# EAGLE schematic FPGA board V2 (EAGLE 7.6.0)

## Sheet 1 of 6: Power
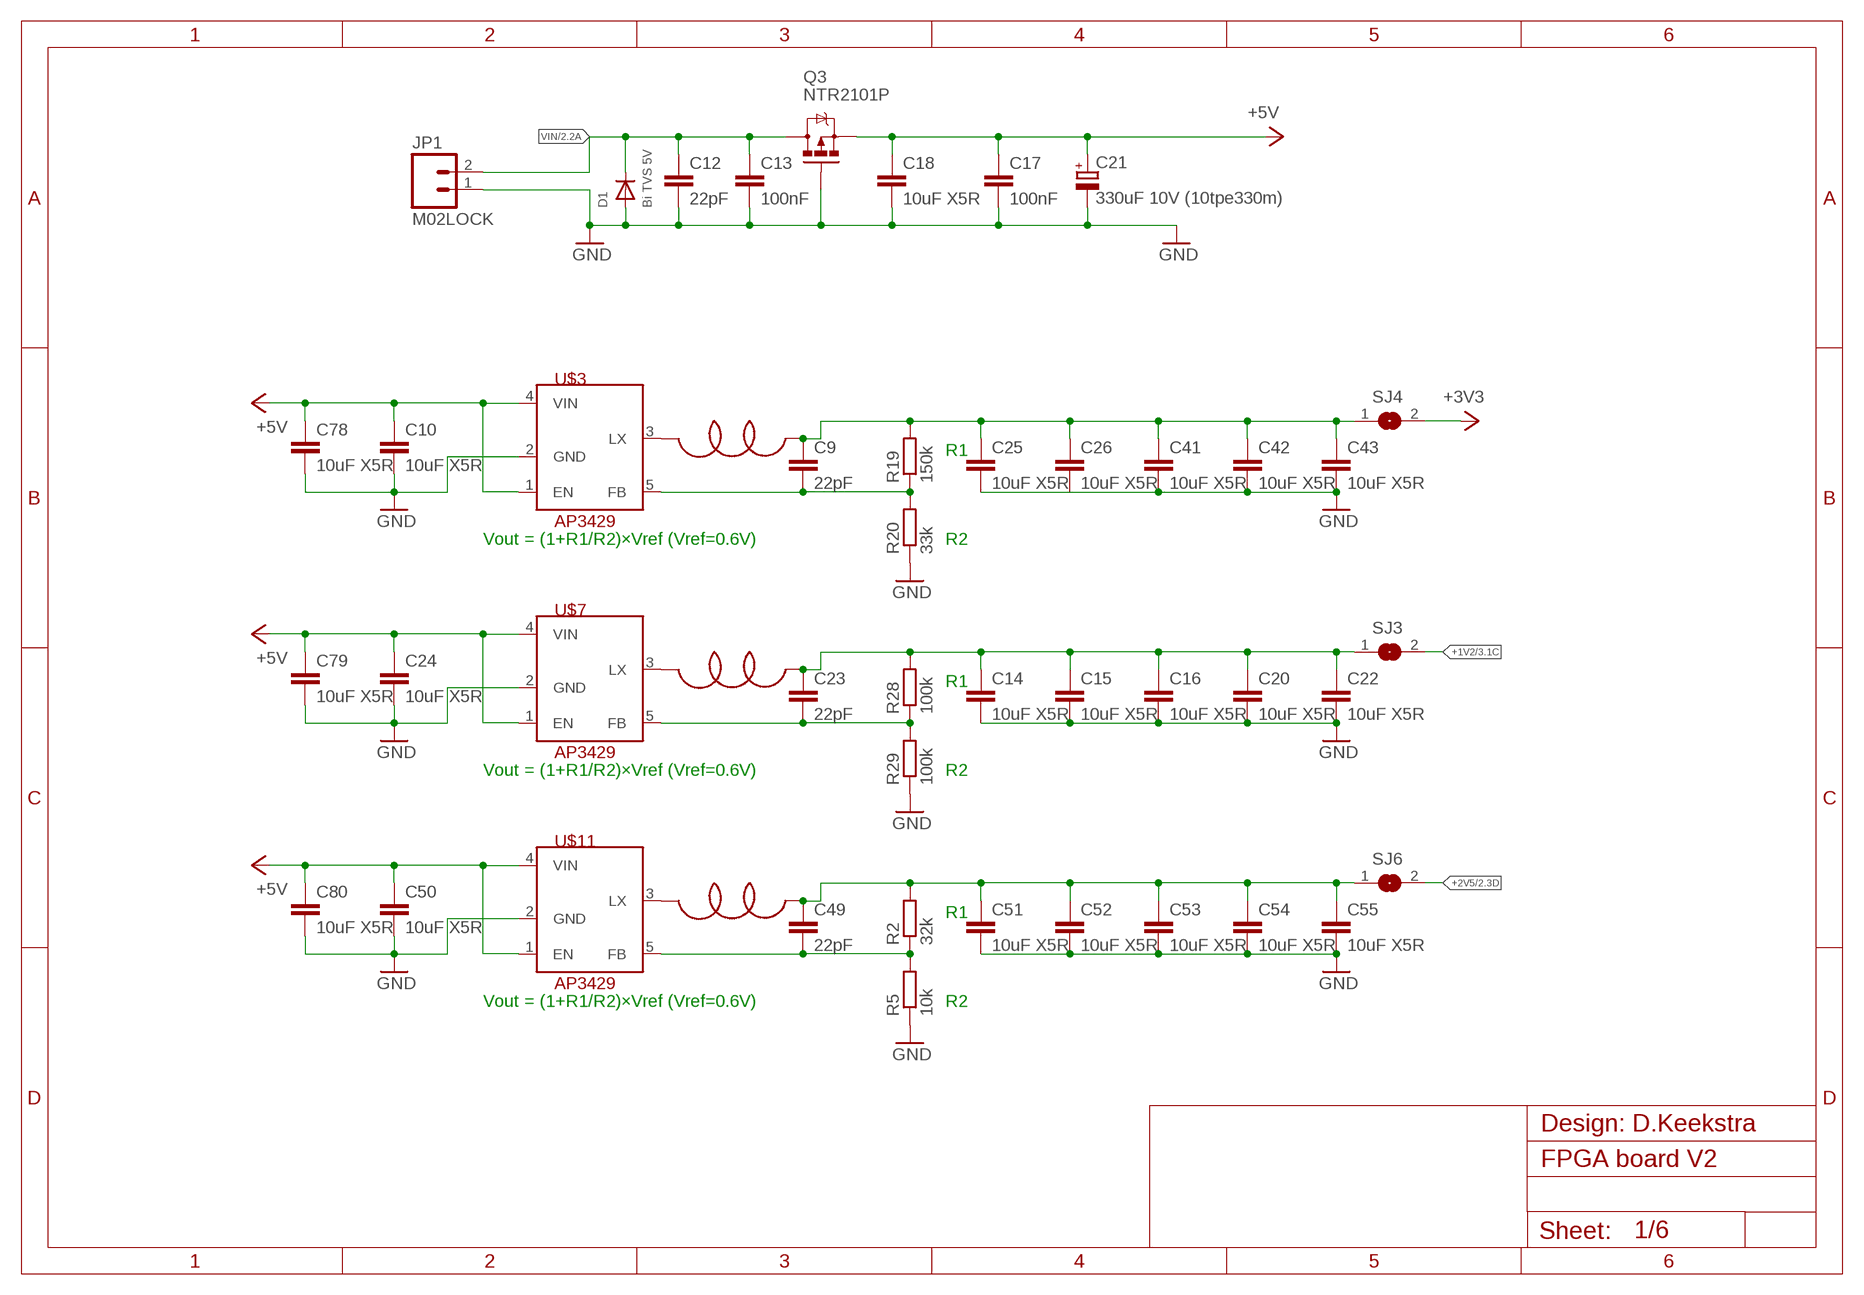
[diagram p0: schematic, sheet 1]

### Parts
C9  22pF  C-EUC0603  [C0603]
C10  10uF X5R  C-EUC0805K  [C0805K]
C12  22pF  C-EUC0603  [C0603]
C13  100nF  C-EUC0603  [C0603]
C14  10uF X5R  C-EUC0805K  [C0805K]
C15  10uF X5R  C-EUC0805K  [C0805K]
C16  10uF X5R  C-EUC0805K  [C0805K]
C17  100nF  C-EUC0603  [C0603]
C18  10uF X5R  C-EUC0805K  [C0805K]
C20  10uF X5R  C-EUC0805K  [C0805K]
C21  330uF 10V (10tpe330m)  CPOL-EUD/7343-31W  [D/7343-31W]
C22  10uF X5R  C-EUC0805K  [C0805K]
C23  22pF  C-EUC0603  [C0603]
C24  10uF X5R  C-EUC0805K  [C0805K]
C25  10uF X5R  C-EUC0805K  [C0805K]
C26  10uF X5R  C-EUC0805K  [C0805K]
C41  10uF X5R  C-EUC0805K  [C0805K]
C42  10uF X5R  C-EUC0805K  [C0805K]
C43  10uF X5R  C-EUC0805K  [C0805K]
C49  22pF  C-EUC0603  [C0603]
C50  10uF X5R  C-EUC0805K  [C0805K]
C51  10uF X5R  C-EUC0805K  [C0805K]
C52  10uF X5R  C-EUC0805K  [C0805K]
C53  10uF X5R  C-EUC0805K  [C0805K]
C54  10uF X5R  C-EUC0805K  [C0805K]
C55  10uF X5R  C-EUC0805K  [C0805K]
C78  10uF X5R  C-EUC0805K  [C0805K]
C79  10uF X5R  C-EUC0805K  [C0805K]
C80  10uF X5R  C-EUC0805K  [C0805K]
D1  Bi TVS 5V  DIODESOD-523  [SOD-523]
JP1  M02LOCK  [1X02_LOCK]
L2  3.3uH 1.9A PWR  SLF7032T3R3M1R9-2-PF  [SLF7032T]
L3  3.3uH 1.9A PWR  SLF7032T3R3M1R9-2-PF  [SLF7032T]
L4  3.3uH 1.9A PWR  SLF7032T3R3M1R9-2-PF  [SLF7032T]
Q3  NTR2101P  MOSFET-PCHANNELIRLML2244  [SOT23-3]
R2  32k  R-EU_R0603  [R0603]
R5  10k  R-EU_R0603  [R0603]
R19  150k  R-EU_R0603  [R0603]
R20  33k  R-EU_R0603  [R0603]
R28  100k  R-EU_R0603  [R0603]
R29  100k  R-EU_R0603  [R0603]
SJ3  SJ  [SJ]
SJ4  SJ  [SJ]
SJ6  SJ  [SJ]
U$3  AP3429  [TSOT-25]
U$7  AP3429  [TSOT-25]
U$11  AP3429  [TSOT-25]

### Nets
+1V2: SJ3.2 ; also sheet 3
+2V5: SJ6.2 ; also sheet 2,3
+3V3: SJ4.2 ; also sheet 3,4,5,6
+5V: C10.1 C17.1 C18.1 C21.+ C24.1 C50.1 C78.1 C79.1 C80.1 Q3.2(S) U$3.1(EN) U$3.4(VIN) U$7.1(EN) U$7.4(VIN) U$11.1(EN) U$11.4(VIN) ; also sheet 6
GND: C10.2 C12.2 C13.2 C14.2 C15.2 C16.2 C17.2 C18.2 C20.2 C21.- C22.2 C24.2 C25.2 C26.2 C41.2 C42.2 C43.2 C50.2 C51.2 C52.2 C53.2 C54.2 C55.2 C78.2 C79.2 C80.2 D1.A JP1.1 Q3.1(G) R5.1 R20.1 R29.1 U$3.2(GND) U$7.2(GND) U$11.2(GND) ; also sheet 2,3,4,5,6
L2: C9.1 C25.1 C26.1 C41.1 C42.1 C43.1 L2.P$1 R19.2 SJ4.1
N$4: L3.P$2 U$11.3(LX)
N$8: C49.1 C51.1 C52.1 C53.1 C54.1 C55.1 L3.P$1 R2.2 SJ6.1
N$9: C49.2 R2.1 R5.2 U$11.5(FB)
N$29: C14.1 C15.1 C16.1 C20.1 C22.1 C23.1 L4.P$1 R28.2 SJ3.1
N$30: C23.2 R28.1 R29.2 U$7.5(FB)
N$78: L2.P$2 U$3.3(LX)
N$82: C9.2 R19.1 R20.2 U$3.5(FB)
N$88: L4.P$2 U$7.3(LX)
VIN: C12.1 C13.1 D1.K(C) JP1.2 Q3.3(D) ; also sheet 2

### Notes on the sheet
- R1
- Vout = (1+R1/R2)×Vref (Vref=0.6V) | R2
- R1
- Vout = (1+R1/R2)×Vref (Vref=0.6V) | R2
- R1
- Vout = (1+R1/R2)×Vref (Vref=0.6V) | R2
- Design: D.Keekstra

## Sheet 2 of 6: USB-Blaster
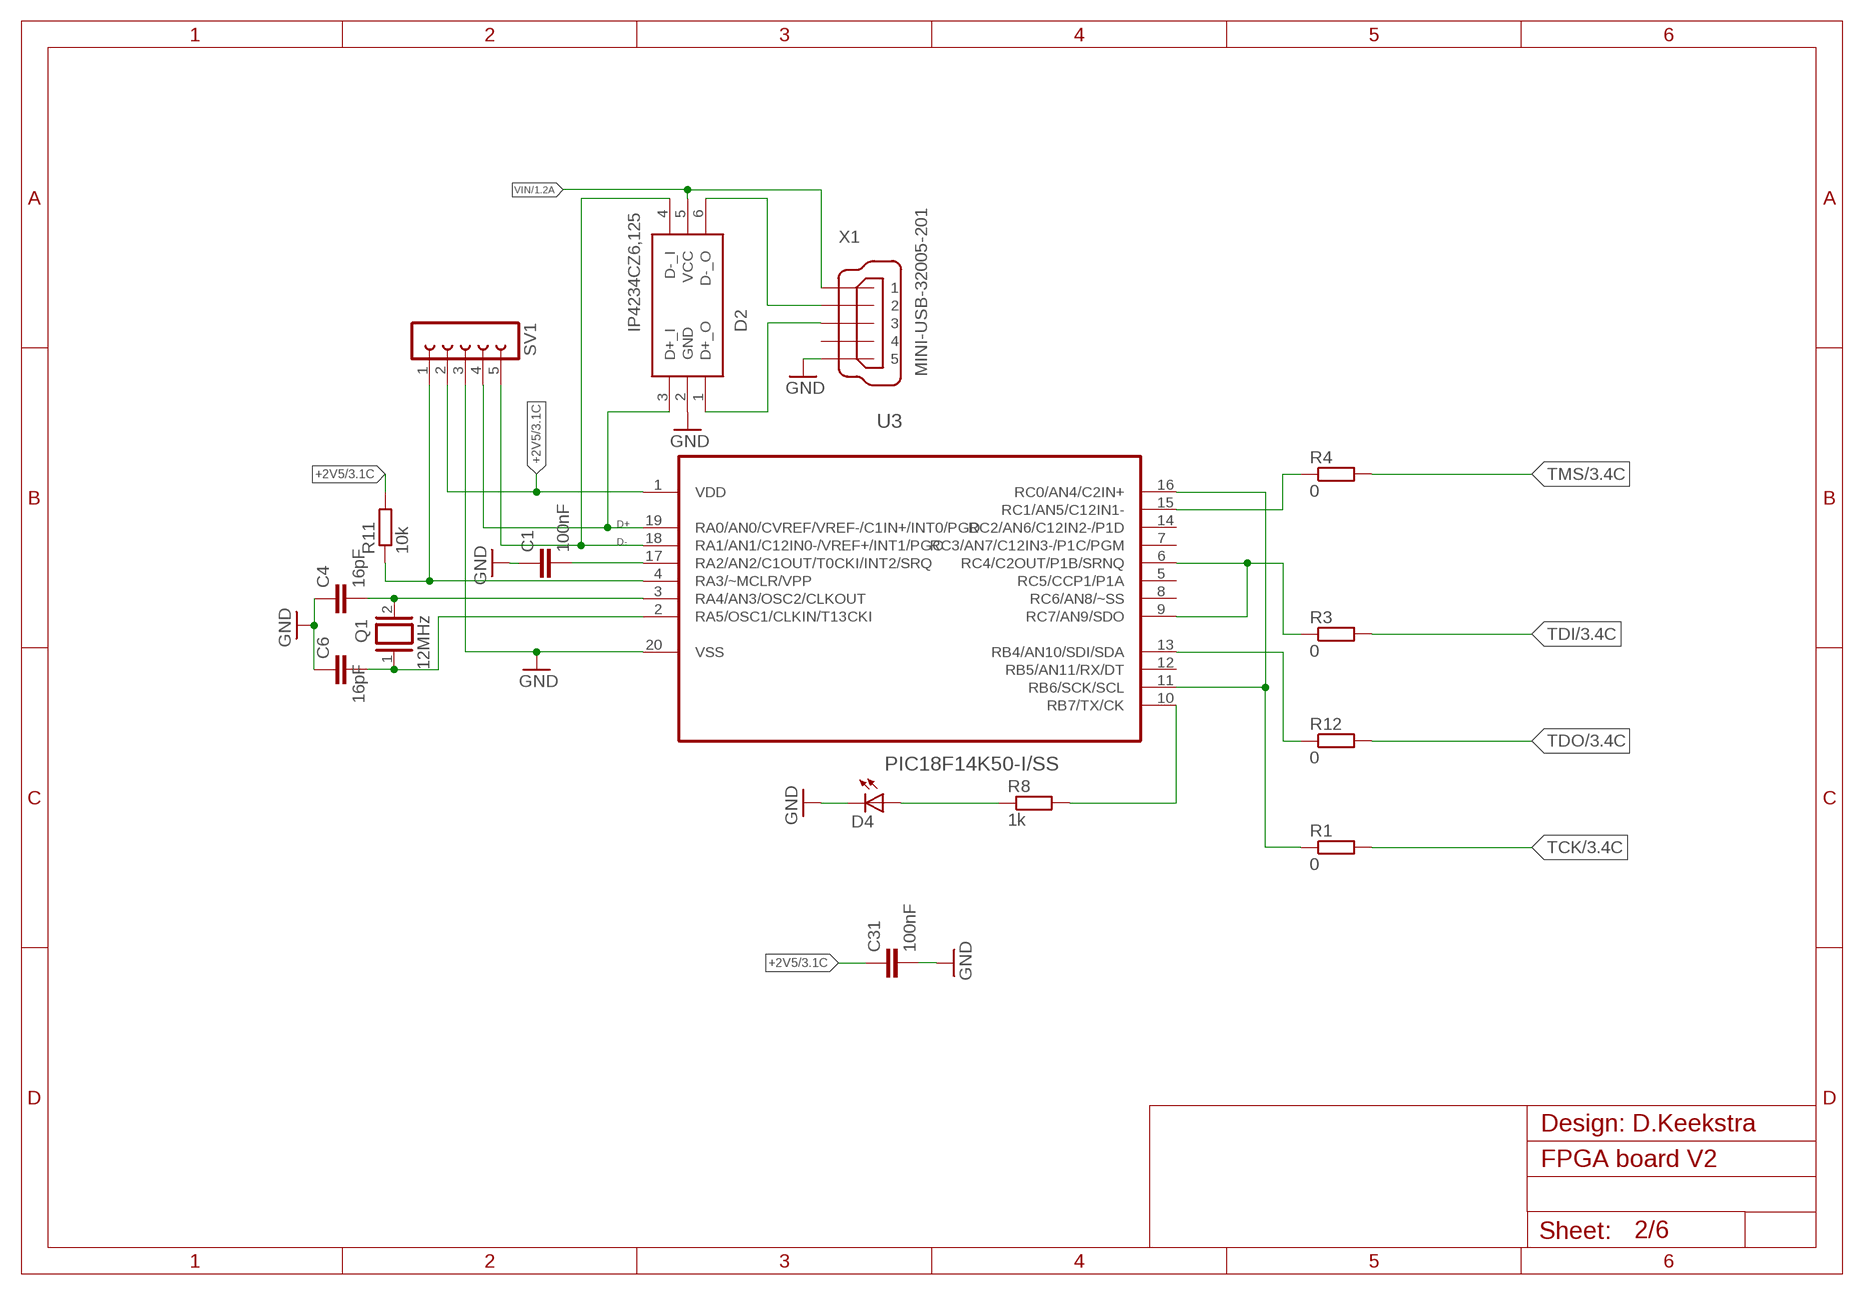
[diagram p1: schematic, sheet 2]

### Parts
C1  100nF  C-EUC0603  [C0603]
C4  16pF  C-EUC0603  [C0603]
C6  16pF  C-EUC0603  [C0603]
C31  100nF  C-EUC0603  [C0603]
D2  IP4234CZ6,125  [SOT95P275X110-6N]
D4  LED0805  [CHIPLED_0805]
Q1  12MHz  XTAL/S  [QS]
R1  0  R-EU_R0603  [R0603]
R3  0  R-EU_R0603  [R0603]
R4  0  R-EU_R0603  [R0603]
R8  1k  R-EU_R0603  [R0603]
R11  10k  R-EU_R0603  [R0603]
R12  0  R-EU_R0603  [R0603]
SV1  FE05-1  [FE05-1]
U3  PIC18F14K50-I/SS  [SOP65P780X200-20N]
X1  MINI-USB-32005-201  [32005-201]

### Nets
+2V5: C31.1 R11.2 SV1.2 U3.1(VDD) ; also sheet 1,3
D+: D2.3(D+_I) SV1.4 U3.19(RA0/AN0/CVREF/VREF-/C1IN+/INT0/PGD)
D-: D2.4(D-_I) SV1.5 U3.18(RA1/AN1/C12IN0-/VREF+/INT1/PGC)
GND: C1.1 C4.1 C6.1 C31.2 D2.2(GND) D4.C SV1.3 U3.20(VSS) X1.5 ; also sheet 1,3,4,5,6
N$1: R8.2 U3.10(RB7/TX/CK)
N$2: D4.A R8.1
N$3: R1.1 U3.11(RB6/SCK/SCL) U3.16(RC0/AN4/C2IN+)
N$5: C1.2 U3.17(RA2/AN2/C1OUT/T0CKI/INT2/SRQ)
N$6: R4.1 U3.15(RC1/AN5/C12IN1-)
N$7: R11.1 SV1.1 U3.4(RA3/~MCLR/VPP)
N$10: R3.1 U3.6(RC4/C2OUT/P1B/SRNQ) U3.9(RC7/AN9/SDO)
N$11: D2.1(D+_O) X1.3
N$12: R12.1 U3.13(RB4/AN10/SDI/SDA)
N$13: D2.6(D-_O) X1.2
N$16: C4.2 Q1.2 U3.3(RA4/AN3/OSC2/CLKOUT)
N$17: C6.2 Q1.1 U3.2(RA5/OSC1/CLKIN/T13CKI)
TCK: R1.2 ; also sheet 3
TDI: R3.2 ; also sheet 3
TDO: R12.2 ; also sheet 3
TMS: R4.2 ; also sheet 3
VIN: D2.5(VCC) X1.1 ; also sheet 1
Unconnected: U3.5(RC5/CCP1/P1A) U3.7(RC3/AN7/C12IN3-/P1C/PGM) U3.8(RC6/AN8/~SS) U3.12(RB5/AN11/RX/DT) U3.14(RC2/AN6/C12IN2-/P1D) X1.4

### Notes on the sheet
- Design: D.Keekstra

## Sheet 3 of 6: FPGA
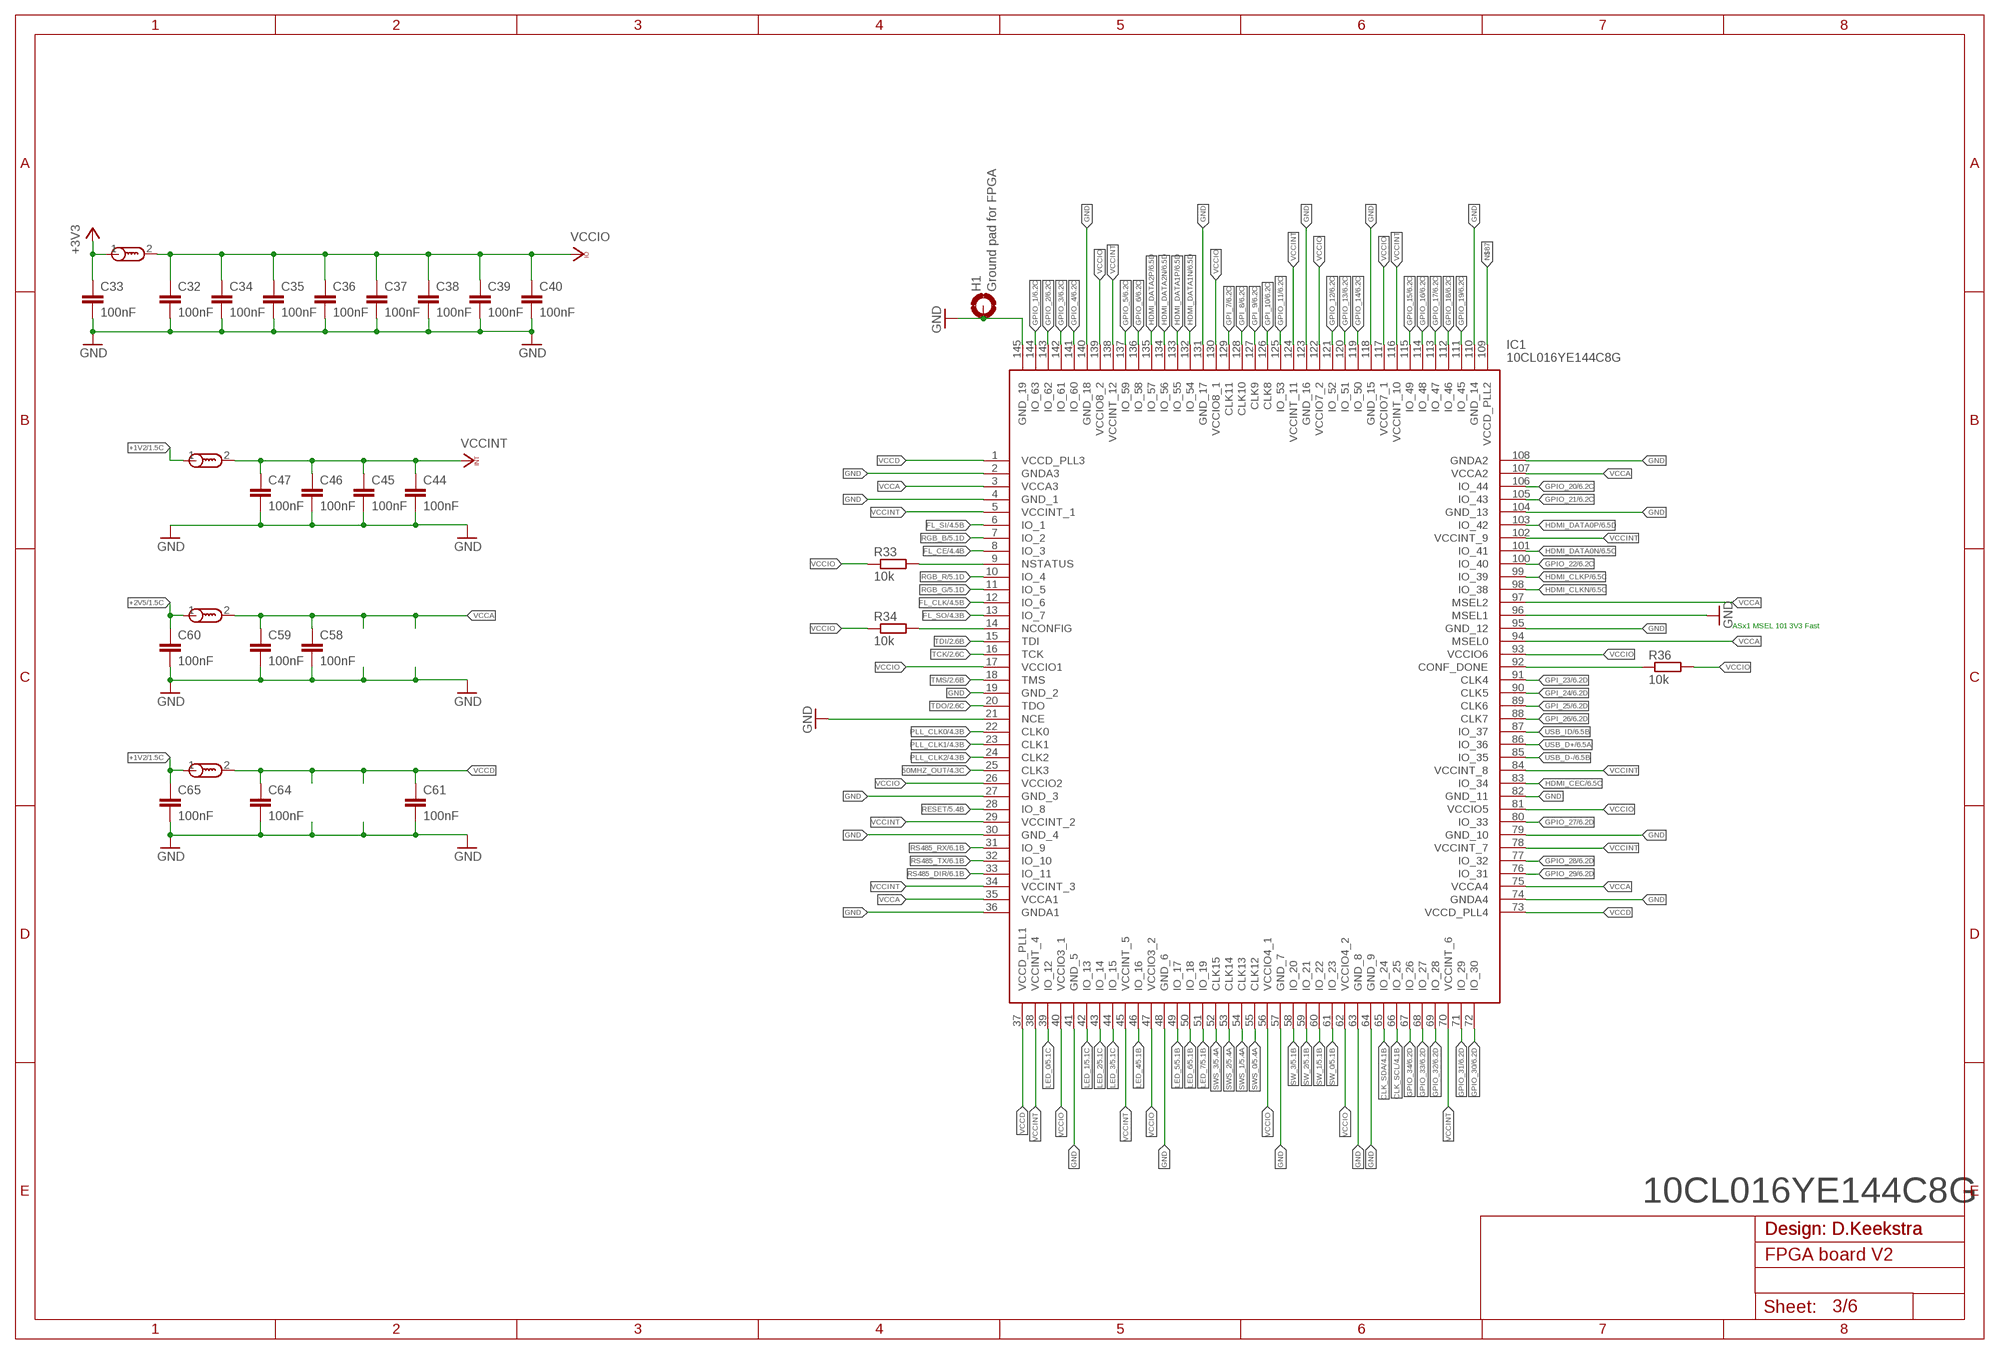
[diagram p2: schematic, sheet 3]

### Parts
B1  B-EU  [C0603]
B2  B-EU  [C0603]
B3  B-EU  [C0603]
B4  B-EU  [C0603]
C32  100nF  C-EUC0603  [C0603]
C33  100nF  C-EUC0603  [C0603]
C34  100nF  C-EUC0603  [C0603]
C35  100nF  C-EUC0603  [C0603]
C36  100nF  C-EUC0603  [C0603]
C37  100nF  C-EUC0603  [C0603]
C38  100nF  C-EUC0603  [C0603]
C39  100nF  C-EUC0603  [C0603]
C40  100nF  C-EUC0603  [C0603]
C44  100nF  C-EUC0603  [C0603]
C45  100nF  C-EUC0603  [C0603]
C46  100nF  C-EUC0603  [C0603]
C47  100nF  C-EUC0603  [C0603]
C58  100nF  C-EUC0603  [C0603]
C59  100nF  C-EUC0603  [C0603]
C60  100nF  C-EUC0603  [C0603]
C61  100nF  C-EUC0603  [C0603]
C64  100nF  C-EUC0603  [C0603]
C65  100nF  C-EUC0603  [C0603]
H1  Ground pad for FPGA  MOUNT-PAD-ROUND2.8  [2,8-PAD]
IC1  10CL016YE144C8G  [QFP50P2200X2200X165-145N]
R33  10k  R-EU_R0603  [R0603]
R34  10k  R-EU_R0603  [R0603]
R36  10k  R-EU_R0603  [R0603]

### Nets
50MHZ_OUT: IC1.25(CLK3) ; also sheet 4
+1V2: B2.1 B4.1 C65.1 ; also sheet 1
+2V5: B3.1 C60.1 ; also sheet 1,2
+3V3: B1.1 C33.1 ; also sheet 1,4,5,6
CLK_SCL: IC1.66(IO_25) ; also sheet 4,6
CLK_SDA: IC1.65(IO_24) ; also sheet 4,6
FL_CE: IC1.8(IO_3) ; also sheet 4
FL_CLK: IC1.12(IO_6) ; also sheet 4
FL_SI: IC1.6(IO_1) ; also sheet 4
FL_SO: IC1.13(IO_7) ; also sheet 4
GND: C32.2 C33.2 C34.2 C35.2 C36.2 C37.2 C38.2 C39.2 C40.2 C44.2 C45.2 C46.2 C47.2 C58.2 C59.2 C60.2 C61.2 C64.2 C65.2 H1.B2,8(MOUNT) IC1.2(GNDA3) IC1.4(GND_1) IC1.19(GND_2) IC1.21(NCE) IC1.27(GND_3) IC1.30(GND_4) IC1.36(GNDA1) IC1.41(GND_5) IC1.48(GND_6) IC1.57(GND_7) IC1.63(GND_8) IC1.64(GND_9) IC1.74(GNDA4) IC1.79(GND_10) IC1.82(GND_11) IC1.95(GND_12) IC1.96(MSEL1) IC1.104(GND_13) IC1.108(GNDA2) IC1.110(GND_14) IC1.118(GND_15) IC1.123(GND_16) IC1.131(GND_17) IC1.140(GND_18) IC1.145(GND_19) ; also sheet 1,2,4,5,6
GPI_7: IC1.129(CLK11) ; also sheet 6
GPI_8: IC1.128(CLK10) ; also sheet 6
GPI_9: IC1.127(CLK9) ; also sheet 6
GPI_10: IC1.126(CLK8) ; also sheet 6
GPI_23: IC1.91(CLK4) ; also sheet 6
GPI_24: IC1.90(CLK5) ; also sheet 6
GPI_25: IC1.89(CLK6) ; also sheet 6
GPI_26: IC1.88(CLK7) ; also sheet 6
GPIO_1: IC1.144(IO_63) ; also sheet 6
GPIO_2: IC1.143(IO_62) ; also sheet 6
GPIO_3: IC1.142(IO_61) ; also sheet 6
GPIO_4: IC1.141(IO_60) ; also sheet 6
GPIO_5: IC1.137(IO_59) ; also sheet 6
GPIO_6: IC1.136(IO_58) ; also sheet 6
GPIO_11: IC1.125(IO_53) ; also sheet 6
GPIO_12: IC1.121(IO_52) ; also sheet 6
GPIO_13: IC1.120(IO_51) ; also sheet 6
GPIO_14: IC1.119(IO_50) ; also sheet 6
GPIO_15: IC1.115(IO_49) ; also sheet 6
GPIO_16: IC1.114(IO_48) ; also sheet 6
GPIO_17: IC1.113(IO_47) ; also sheet 6
GPIO_18: IC1.112(IO_46) ; also sheet 6
GPIO_19: IC1.111(IO_45) ; also sheet 6
GPIO_20: IC1.106(IO_44) ; also sheet 6
GPIO_21: IC1.105(IO_43) ; also sheet 6
GPIO_22: IC1.100(IO_40) ; also sheet 6
GPIO_27: IC1.80(IO_33) ; also sheet 6
GPIO_28: IC1.77(IO_32) ; also sheet 6
GPIO_29: IC1.76(IO_31) ; also sheet 6
GPIO_30: IC1.72(IO_30) ; also sheet 6
GPIO_31: IC1.71(IO_29) ; also sheet 6
GPIO_32: IC1.69(IO_28) ; also sheet 6
GPIO_33: IC1.68(IO_27) ; also sheet 6
GPIO_34: IC1.67(IO_26) ; also sheet 6
HDMI_CEC: IC1.83(IO_34) ; also sheet 6
HDMI_CLKN: IC1.98(IO_38) ; also sheet 6
HDMI_CLKP: IC1.99(IO_39) ; also sheet 6
HDMI_DATA0N: IC1.101(IO_41) ; also sheet 6
HDMI_DATA0P: IC1.103(IO_42) ; also sheet 6
HDMI_DATA1N: IC1.132(IO_54) ; also sheet 6
HDMI_DATA1P: IC1.133(IO_55) ; also sheet 6
HDMI_DATA2N: IC1.134(IO_56) ; also sheet 6
HDMI_DATA2P: IC1.135(IO_57) ; also sheet 6
LED_0: IC1.39(IO_12) ; also sheet 5
LED_1: IC1.42(IO_13) ; also sheet 5
LED_2: IC1.43(IO_14) ; also sheet 5
LED_3: IC1.44(IO_15) ; also sheet 5
LED_4: IC1.46(IO_16) ; also sheet 5
LED_5: IC1.49(IO_17) ; also sheet 5
LED_6: IC1.50(IO_18) ; also sheet 5
LED_7: IC1.51(IO_19) ; also sheet 5
N$24: IC1.9(NSTATUS) R33.2
N$31: IC1.14(NCONFIG) R34.2
N$33: IC1.92(CONF_DONE) R36.1
N$87: IC1.109(VCCD_PLL2)
PLL_CLK0: IC1.22(CLK0) ; also sheet 4
PLL_CLK1: IC1.23(CLK1) ; also sheet 4
PLL_CLK2: IC1.24(CLK2) ; also sheet 4
RESET: IC1.28(IO_8) ; also sheet 5
RGB_B: IC1.7(IO_2) ; also sheet 5
RGB_G: IC1.11(IO_5) ; also sheet 5
RGB_R: IC1.10(IO_4) ; also sheet 5
RS485_DIR: IC1.33(IO_11) ; also sheet 6
RS485_RX: IC1.31(IO_9) ; also sheet 6
RS485_TX: IC1.32(IO_10) ; also sheet 6
SW_0: IC1.61(IO_23) ; also sheet 5
SW_1: IC1.60(IO_22) ; also sheet 5
SW_2: IC1.59(IO_21) ; also sheet 5
SW_3: IC1.58(IO_20) ; also sheet 5
SWS_0: IC1.55(CLK12) ; also sheet 5
SWS_1: IC1.54(CLK13) ; also sheet 5
SWS_2: IC1.53(CLK14) ; also sheet 5
SWS_3: IC1.52(CLK15) ; also sheet 5
TCK: IC1.16(TCK) ; also sheet 2
TDI: IC1.15(TDI) ; also sheet 2
TDO: IC1.20(TDO) ; also sheet 2
TMS: IC1.18(TMS) ; also sheet 2
USB_D+: IC1.86(IO_36) ; also sheet 6
USB_D-: IC1.85(IO_35) ; also sheet 6
USB_ID: IC1.87(IO_37) ; also sheet 6
VCCA: B3.2 C58.1 C59.1 IC1.3(VCCA3) IC1.35(VCCA1) IC1.75(VCCA4) IC1.94(MSEL0) IC1.97(MSEL2) IC1.107(VCCA2)
VCCD: B4.2 C61.1 C64.1 IC1.1(VCCD_PLL3) IC1.37(VCCD_PLL1) IC1.73(VCCD_PLL4)
VCCINT: B2.2 C44.1 C45.1 C46.1 C47.1 IC1.5(VCCINT_1) IC1.29(VCCINT_2) IC1.34(VCCINT_3) IC1.38(VCCINT_4) IC1.45(VCCINT_5) IC1.70(VCCINT_6) IC1.78(VCCINT_7) IC1.84(VCCINT_8) IC1.102(VCCINT_9) IC1.116(VCCINT_10) IC1.124(VCCINT_11) IC1.138(VCCINT_12)
VCCIO: B1.2 C32.1 C34.1 C35.1 C36.1 C37.1 C38.1 C39.1 C40.1 IC1.17(VCCIO1) IC1.26(VCCIO2) IC1.40(VCCIO3_1) IC1.47(VCCIO3_2) IC1.56(VCCIO4_1) IC1.62(VCCIO4_2) IC1.81(VCCIO5) IC1.93(VCCIO6) IC1.117(VCCIO7_1) IC1.122(VCCIO7_2) IC1.130(VCCIO8_1) IC1.139(VCCIO8_2) R33.1 R34.1 R36.2

### Notes on the sheet
- ASx1 MSEL 101 3V3 Fast
- 10CL016YE144C8G
- Design: D.Keekstra | Design: D.Keekstra

## Sheet 4 of 6: Clocks and Memory
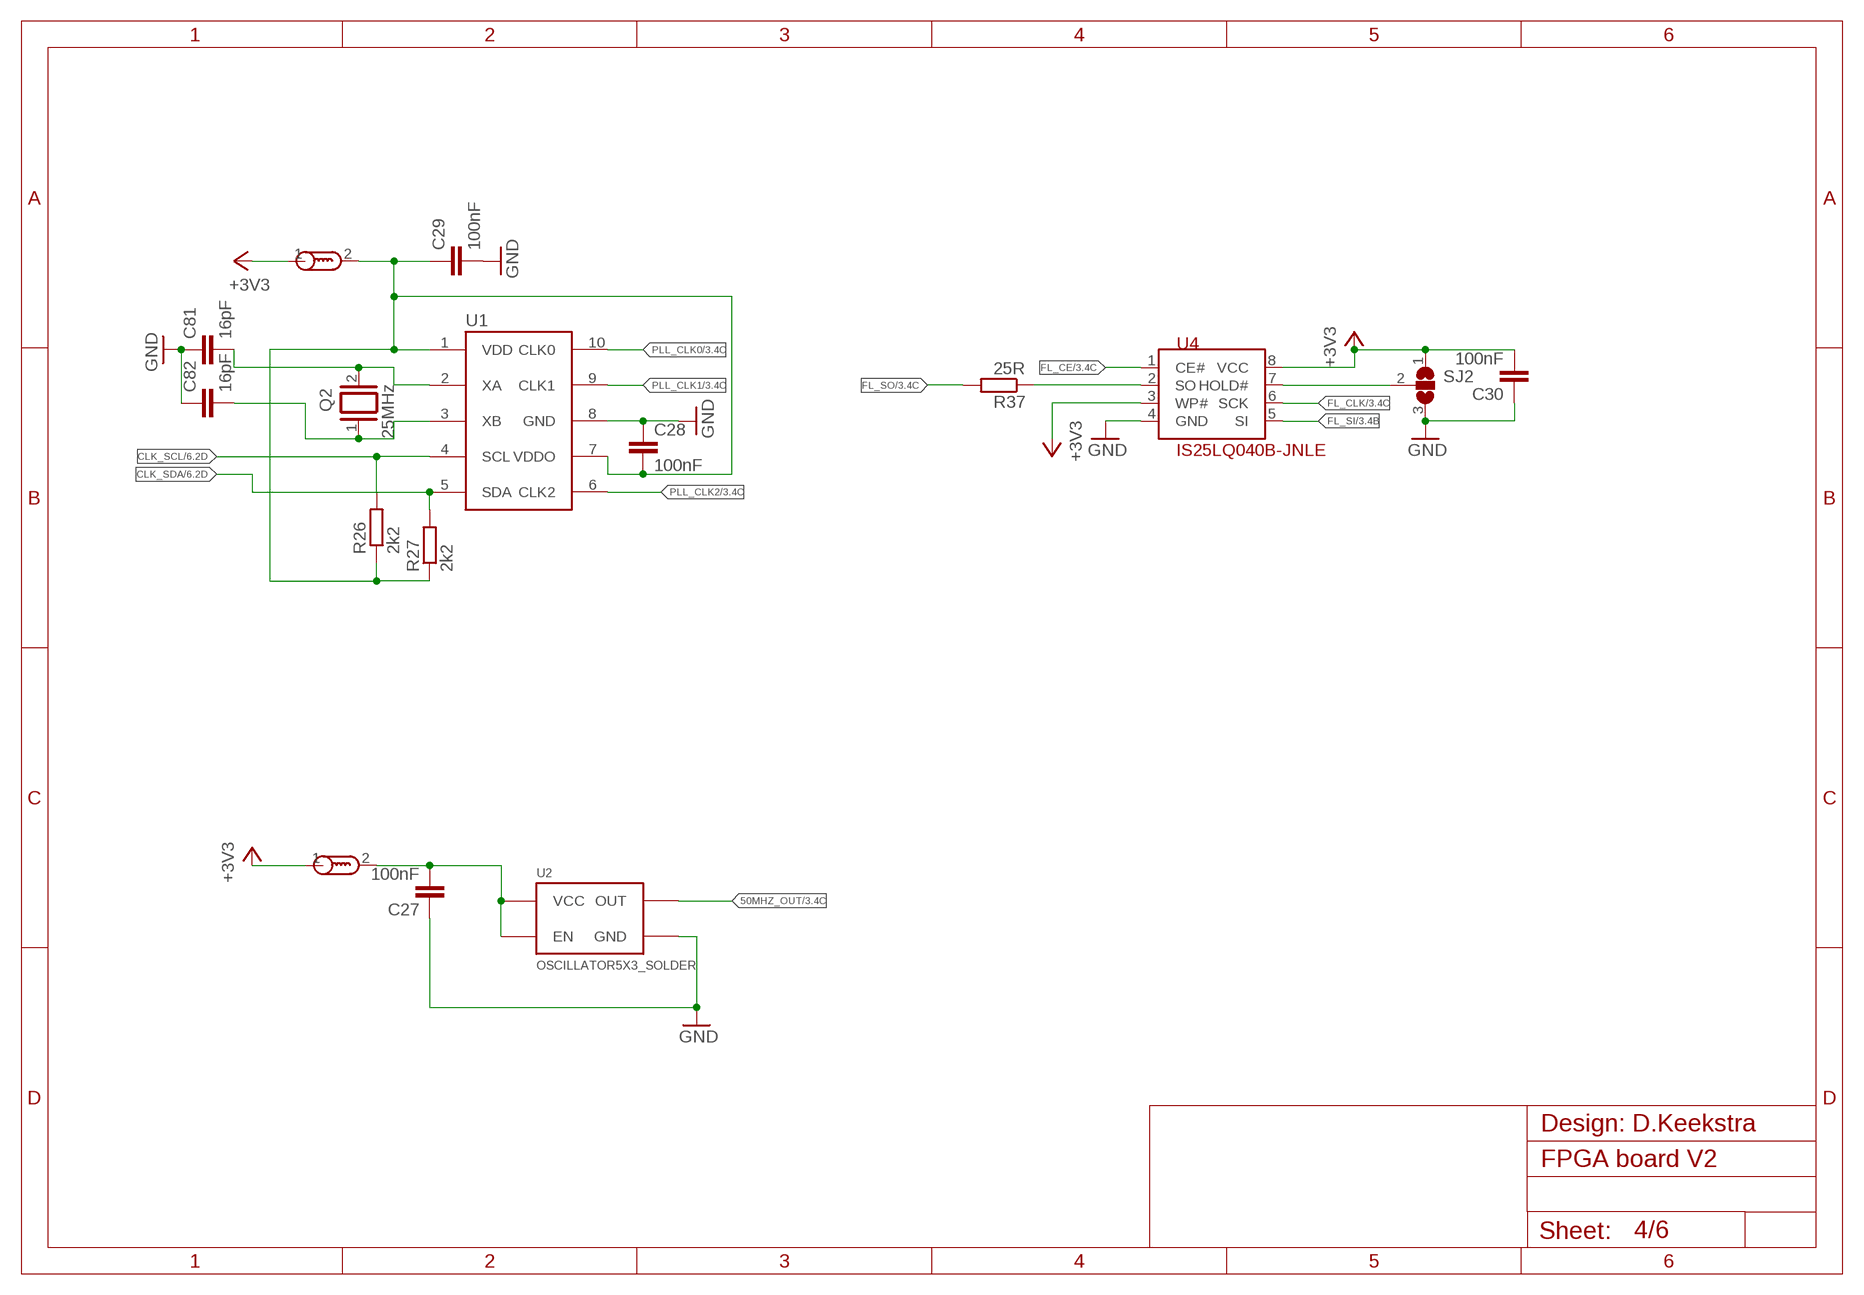
[diagram p3: schematic, sheet 4]

### Parts
B5  B-EU  [C0603]
B6  B-EU  [C0603]
C27  100nF  C-EUC0603  [C0603]
C28  100nF  C-EUC0603  [C0603]
C29  100nF  C-EUC0603  [C0603]
C30  100nF  C-EUC0603  [C0603]
C81  16pF  C-EUC0603  [C0603]
C82  16pF  C-EUC0603  [C0603]
Q2  25MHz  XTAL/S  [QS]
R26  2k2  R-EU_R0603  [R0603]
R27  2k2  R-EU_R0603  [R0603]
R37  25R  R-EU_R0603  [R0603]
SJ2  SJ2W  [SJ_2]
U1  SI5351A_CLOCK_GEN  [MSOP-10]
U2  OSCILLATOR5X3_SOLDER  [CRYSTAL-SMD-5X3_SOLDER]
U4  IS25LQ040B-JNLE  [SOIC8]

### Nets
50MHZ_OUT: U2.3(OUT) ; also sheet 3
+3V3: B5.1 B6.1 C30.2 SJ2.1 U4.3(WP#) U4.8(VCC) ; also sheet 1,3,5,6
CLK_SCL: R26.2 U1.4(SCL) ; also sheet 3,6
CLK_SDA: R27.2 U1.5(SDA) ; also sheet 3,6
FL_CE: U4.1(CE#) ; also sheet 3
FL_CLK: U4.6(SCK) ; also sheet 3
FL_SI: U4.5(SI) ; also sheet 3
FL_SO: R37.2 ; also sheet 3
GND: C27.1 C28.1 C29.2 C30.1 C81.1 C82.1 SJ2.3 U1.8(GND) U2.2(GND) U4.4(GND) ; also sheet 1,2,3,5,6
N$75: C82.2 Q2.1 U1.3(XB)
N$76: C81.2 Q2.2 U1.2(XA)
N$86: SJ2.2 U4.7(HOLD#)
N$91: B6.2 C28.2 C29.1 R26.1 R27.1 U1.1(VDD) U1.7(VDDO)
N$93: B5.2 C27.2 U2.1(EN) U2.4(VCC)
PLL_CLK0: U1.10(CLK0) ; also sheet 3
PLL_CLK1: U1.9(CLK1) ; also sheet 3
PLL_CLK2: U1.6(CLK2) ; also sheet 3
SO: R37.1 U4.2(SO)

### Notes on the sheet
- Design: D.Keekstra

## Sheet 5 of 6: Leds and Buttons
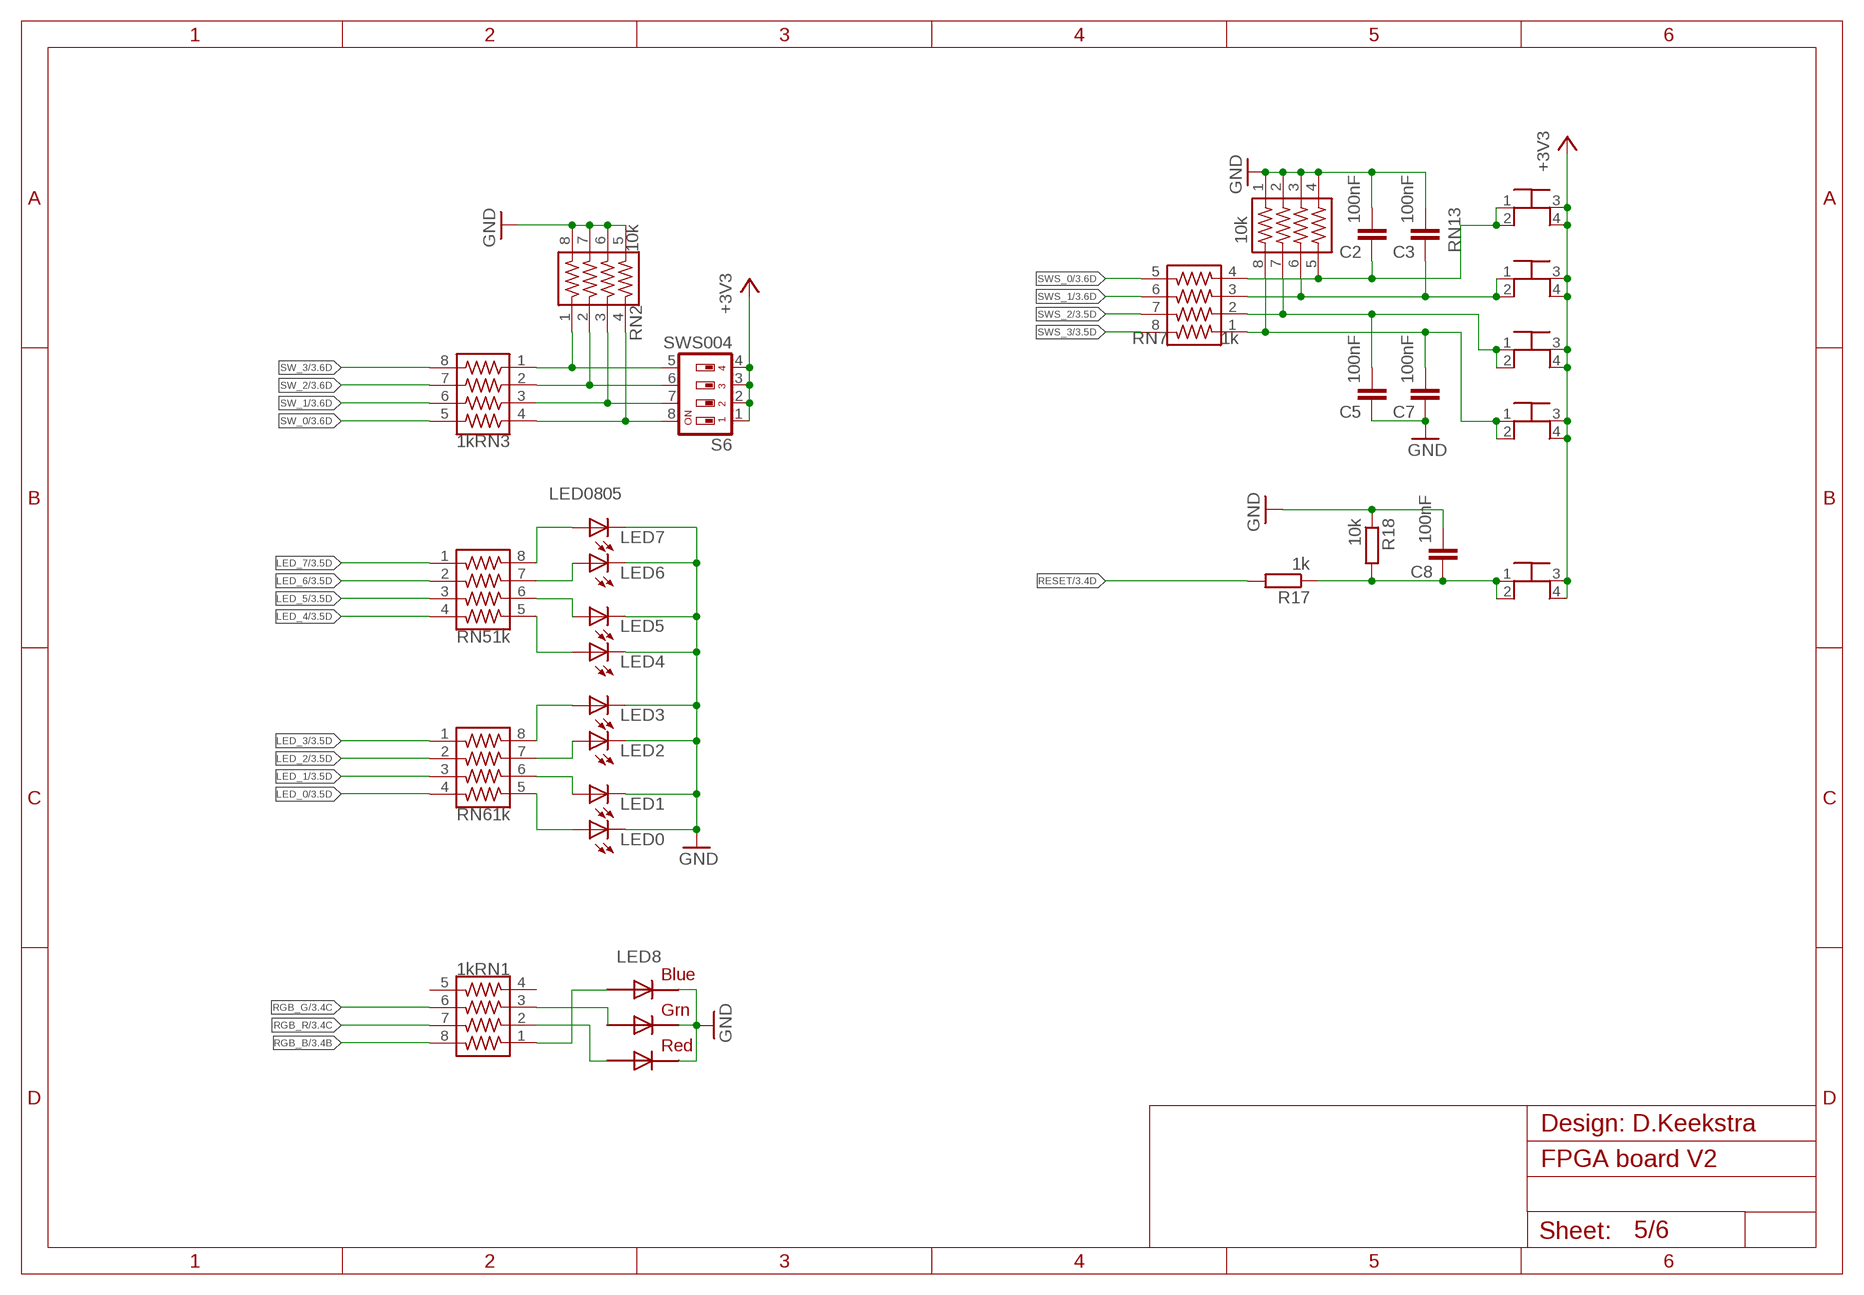
[diagram p4: schematic, sheet 5]

### Parts
C2  100nF  C-EUC0603  [C0603]
C3  100nF  C-EUC0603  [C0603]
C5  100nF  C-EUC0603  [C0603]
C7  100nF  C-EUC0603  [C0603]
C8  100nF  C-EUC0603  [C0603]
LED0  LED0805  [CHIPLED_0805]
LED1  LED0805  [CHIPLED_0805]
LED2  LED0805  [CHIPLED_0805]
LED3  LED0805  [CHIPLED_0805]
LED4  LED0805  [CHIPLED_0805]
LED5  LED0805  [CHIPLED_0805]
LED6  LED0805  [CHIPLED_0805]
LED7  LED0805  [CHIPLED_0805]
LED8  RGBLED5050  [RGBLED5050]
R17  1k  R-EU_R0603  [R0603]
R18  10k  R-EU_R0603  [R0603]
RN1  1k  744-8NS  [744-8NS]
RN2  10k  744-8NS  [744-8NS]
RN3  1k  744-8NS  [744-8NS]
RN5  1k  744-8NS  [744-8NS]
RN6  1k  744-8NS  [744-8NS]
RN7  1k  744-8NS  [744-8NS]
RN13  10k  744-8NS  [744-8NS]
S1  SKQGADE010  [SKQGAKE010]
S2  SKQGADE010  [SKQGAKE010]
S3  SKQGADE010  [SKQGAKE010]
S4  SKQGADE010  [SKQGAKE010]
S5  SKQGADE010  [SKQGAKE010]
S6  SWS004  [SMS-004]

### Nets
+3V3: S1.3 S1.4 S2.3 S2.4 S3.3 S3.4 S4.3 S4.4 S5.3 S5.4 S6.1 S6.2 S6.3 S6.4 ; also sheet 1,3,4,6
GND: C2.2 C3.2 C5.1 C7.1 C8.2 LED0.C LED1.C LED2.C LED3.C LED4.C LED5.C LED6.C LED7.C LED8.4(BLUE_C) LED8.5(RED_C) LED8.6(GREEN_C) R18.1 RN2.5 RN2.6 RN2.7 RN2.8 RN13.1 RN13.2 RN13.3 RN13.4 ; also sheet 1,2,3,4,6
LED_0: RN6.4 ; also sheet 3
LED_1: RN6.3 ; also sheet 3
LED_2: RN6.2 ; also sheet 3
LED_3: RN6.1 ; also sheet 3
LED_4: RN5.4 ; also sheet 3
LED_5: RN5.3 ; also sheet 3
LED_6: RN5.2 ; also sheet 3
LED_7: RN5.1 ; also sheet 3
N$15: RN2.3 RN3.3 S6.7
N$22: RN2.1 RN3.1 S6.5
N$23: RN2.2 RN3.2 S6.6
N$25: RN2.4 RN3.4 S6.8
N$45: LED7.A RN5.8
N$46: LED6.A RN5.7
N$47: LED5.A RN5.6
N$48: LED4.A RN5.5
N$49: LED3.A RN6.8
N$51: LED2.A RN6.7
N$52: LED1.A RN6.6
N$53: LED0.A RN6.5
N$57: LED8.1(GREEN_A) RN1.3
N$58: LED8.2(RED_A) RN1.2
N$59: LED8.3(BLUE_A) RN1.1
N$63: C2.1 RN7.4 RN13.5 S4.1 S4.2
N$64: C3.1 RN7.3 RN13.6 S3.1 S3.2
N$65: C5.2 RN7.2 RN13.7 S2.1 S2.2
N$67: C7.2 RN7.1 RN13.8 S1.1 S1.2
N$68: C8.1 R17.1 R18.2 S5.1 S5.2
RESET: R17.2 ; also sheet 3
RGB_B: RN1.8 ; also sheet 3
RGB_G: RN1.6 ; also sheet 3
RGB_R: RN1.7 ; also sheet 3
SW_0: RN3.5 ; also sheet 3
SW_1: RN3.6 ; also sheet 3
SW_2: RN3.7 ; also sheet 3
SW_3: RN3.8 ; also sheet 3
SWS_0: RN7.5 ; also sheet 3
SWS_1: RN7.6 ; also sheet 3
SWS_2: RN7.7 ; also sheet 3
SWS_3: RN7.8 ; also sheet 3
Unconnected: RN1.4 RN1.5

### Notes on the sheet
- Design: D.Keekstra

## Sheet 6 of 6: Connectivity
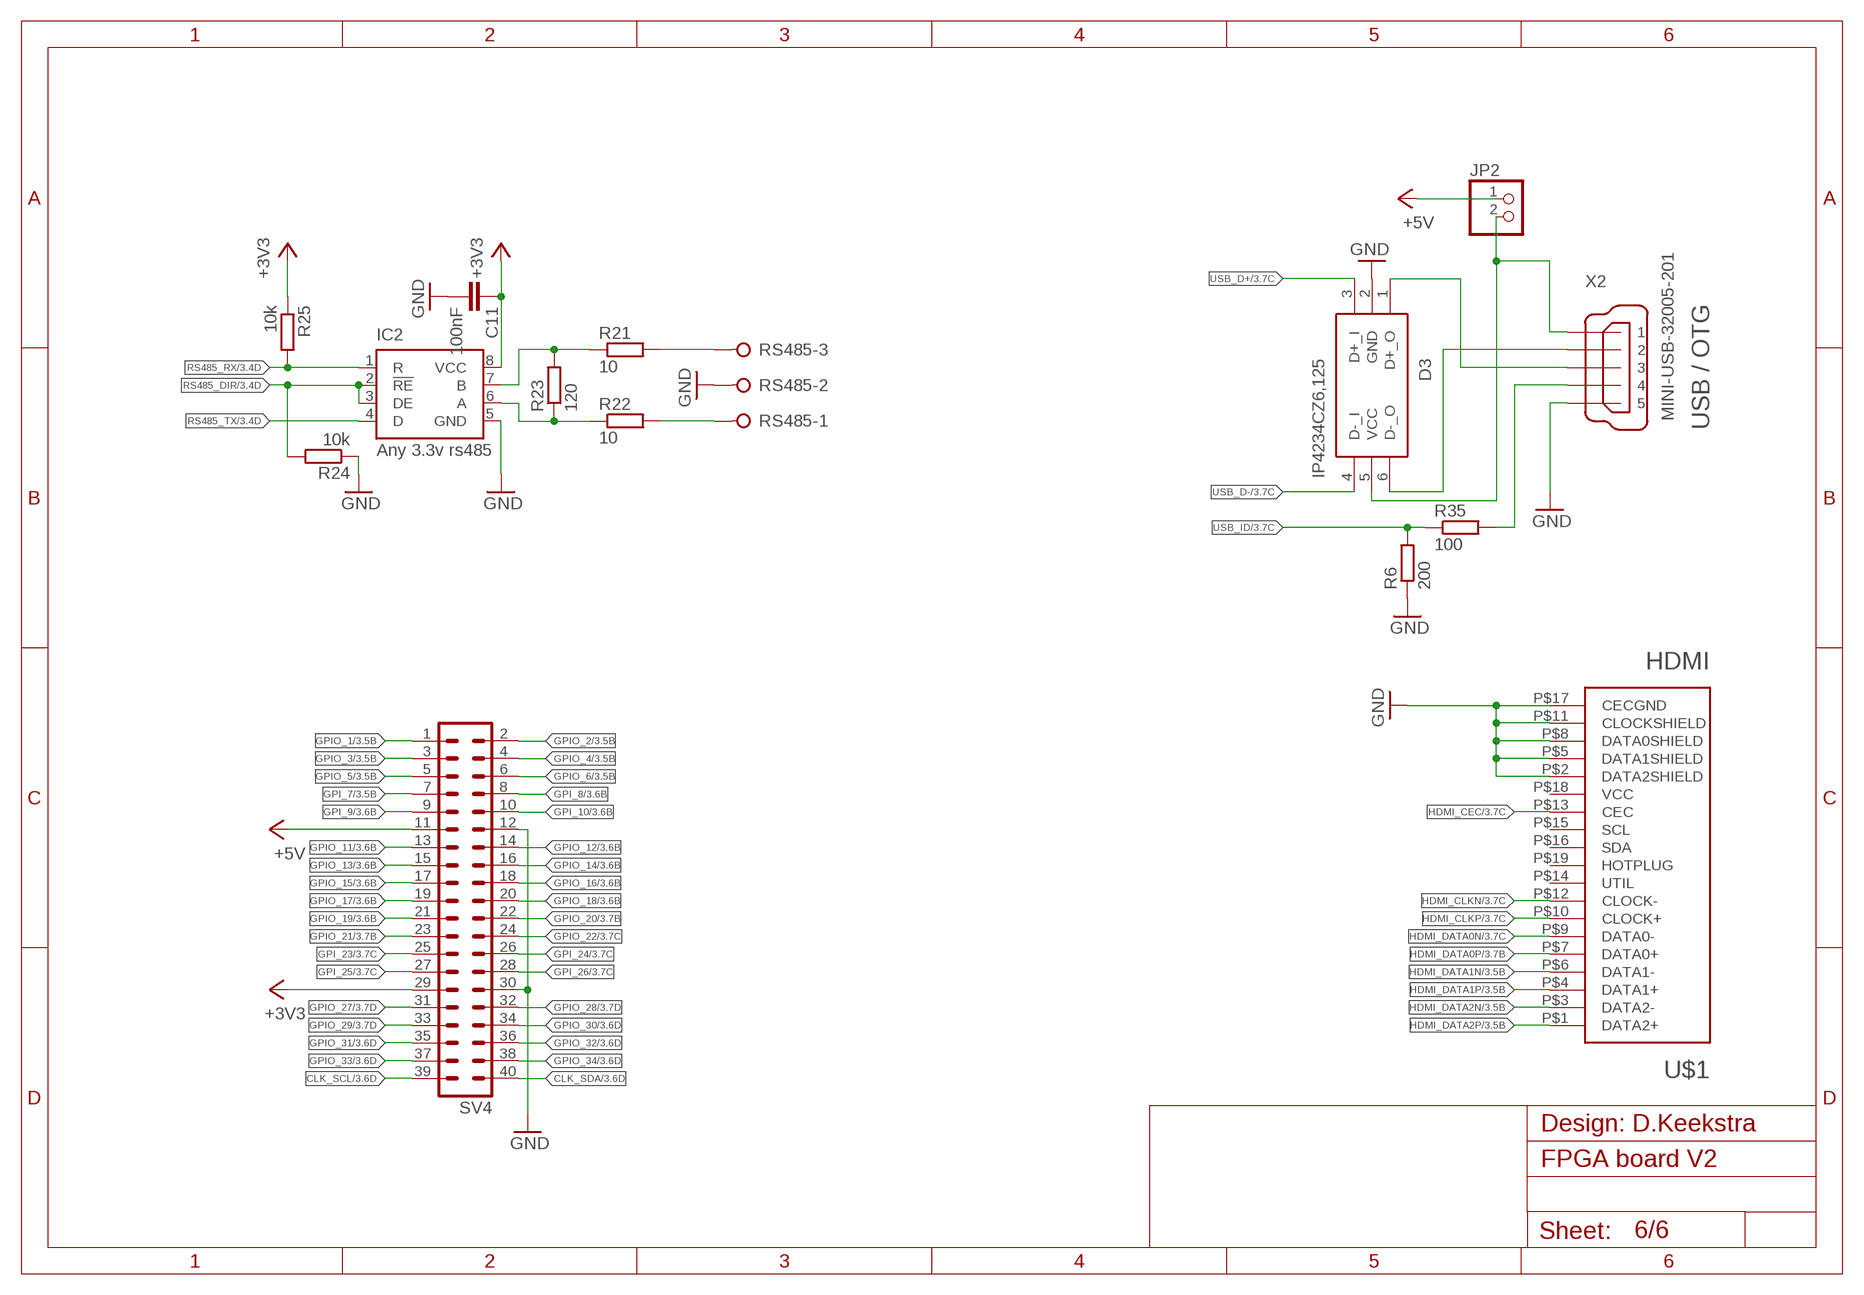
[diagram p5: schematic, sheet 6]

### Parts
C11  100nF  C-EUC0603  [C0603]
D3  IP4234CZ6,125  [SOT95P275X110-6N]
IC2  Any 3.3v rs485  SN65176D  [SO-08]
JP2  PINHD-1X2  [1X02]
R6  200  R-EU_R0603  [R0603]
R21  10  R-EU_R0603  [R0603]
R22  10  R-EU_R0603  [R0603]
R23  120  R-EU_R0603  [R0603]
R24  10k  R-EU_R0603  [R0603]
R25  10k  R-EU_R0603  [R0603]
R35  100  R-EU_R0603  [R0603]
RS485  W237-3E  [W237-3E]
SV4  MA20-2  [MA20-2]
U$1  HDMI  [HDMI_A]
X2  MINI-USB-32005-201  [32005-201]

### Nets
+3V3: C11.1 IC2.8(VCC) R25.1 SV4.29 ; also sheet 1,3,4,5
+5V: JP2.1 SV4.11 ; also sheet 1
CLK_SCL: SV4.39 ; also sheet 3,4
CLK_SDA: SV4.40 ; also sheet 3,4
GND: C11.2 D3.2(GND) IC2.5(GND) R6.1 R24.1 RS485.2 SV4.12 SV4.30 U$1.P$2(DATA2SHIELD) U$1.P$5(DATA1SHIELD) U$1.P$8(DATA0SHIELD) U$1.P$11(CLOCKSHIELD) U$1.P$17(CECGND) X2.5 ; also sheet 1,2,3,4,5
GPI_7: SV4.7 ; also sheet 3
GPI_8: SV4.8 ; also sheet 3
GPI_9: SV4.9 ; also sheet 3
GPI_10: SV4.10 ; also sheet 3
GPI_23: SV4.25 ; also sheet 3
GPI_24: SV4.26 ; also sheet 3
GPI_25: SV4.27 ; also sheet 3
GPI_26: SV4.28 ; also sheet 3
GPIO_1: SV4.1 ; also sheet 3
GPIO_2: SV4.2 ; also sheet 3
GPIO_3: SV4.3 ; also sheet 3
GPIO_4: SV4.4 ; also sheet 3
GPIO_5: SV4.5 ; also sheet 3
GPIO_6: SV4.6 ; also sheet 3
GPIO_11: SV4.13 ; also sheet 3
GPIO_12: SV4.14 ; also sheet 3
GPIO_13: SV4.15 ; also sheet 3
GPIO_14: SV4.16 ; also sheet 3
GPIO_15: SV4.17 ; also sheet 3
GPIO_16: SV4.18 ; also sheet 3
GPIO_17: SV4.19 ; also sheet 3
GPIO_18: SV4.20 ; also sheet 3
GPIO_19: SV4.21 ; also sheet 3
GPIO_20: SV4.22 ; also sheet 3
GPIO_21: SV4.23 ; also sheet 3
GPIO_22: SV4.24 ; also sheet 3
GPIO_27: SV4.31 ; also sheet 3
GPIO_28: SV4.32 ; also sheet 3
GPIO_29: SV4.33 ; also sheet 3
GPIO_30: SV4.34 ; also sheet 3
GPIO_31: SV4.35 ; also sheet 3
GPIO_32: SV4.36 ; also sheet 3
GPIO_33: SV4.37 ; also sheet 3
GPIO_34: SV4.38 ; also sheet 3
HDMI_CEC: U$1.P$13(CEC) ; also sheet 3
HDMI_CLKN: U$1.P$12(CLOCK-) ; also sheet 3
HDMI_CLKP: U$1.P$10(CLOCK+) ; also sheet 3
HDMI_DATA0N: U$1.P$9(DATA0-) ; also sheet 3
HDMI_DATA0P: U$1.P$7(DATA0+) ; also sheet 3
HDMI_DATA1N: U$1.P$6(DATA1-) ; also sheet 3
HDMI_DATA1P: U$1.P$4(DATA1+) ; also sheet 3
HDMI_DATA2N: U$1.P$3(DATA2-) ; also sheet 3
HDMI_DATA2P: U$1.P$1(DATA2+) ; also sheet 3
N$50: D3.6(D-_O) X2.2
N$54: D3.1(D+_O) X2.3
N$77: D3.5(VCC) JP2.2 X2.1
N$80: IC2.7(B) R21.1 R23.2
N$81: IC2.6(A) R22.1 R23.1
N$83: R22.2 RS485.1
N$84: R21.2 RS485.3
N$113: R35.2 X2.4
RS485_DIR: IC2.2(!RE) IC2.3(DE) R24.2 ; also sheet 3
RS485_RX: IC2.1(R) R25.2 ; also sheet 3
RS485_TX: IC2.4(D) ; also sheet 3
USB_D+: D3.3(D+_I) ; also sheet 3
USB_D-: D3.4(D-_I) ; also sheet 3
USB_ID: R6.2 R35.1 ; also sheet 3
Unconnected: U$1.P$14(UTIL) U$1.P$15(SCL) U$1.P$16(SDA) U$1.P$18(VCC) U$1.P$19(HOTPLUG)

### Notes on the sheet
- USB / OTG
- Design: D.Keekstra

## Library data of the parts
B1-B6 = rcl:B-EU: Standart ferrite beads 100mhz 0603; B: 1.2A
C1-C18 C20 C22-C47 C49-C55 C58-C61 C64 C65 C78-C82 = rcl:C-EU: CAPACITOR, European symbol
C21 = rcl:CPOL-EU: POLARIZED CAPACITOR, European symbol
D1 = adafruit:DIODE: Diode SMADIODE - SMA Surface Mount Package 20V 1A Schottky Diode Digikey: 641-1014-6-ND DO-1N4148 - Through Hole Small Current Diode SOD-123 20V 1 A (.5mV Vf) Schottky Diode - Digikey: MBRX120TPMSCT-ND SOD-323 10V 570mA (.38mV Vf, 3ns) Schottky Diode - Digikey: ZLLS410CT-ND SOD-523 30V 30mA Schottky Diode (RB751S-40TE61) - Digikey: RB751S-40TE61CT-ND SOT23-R/W - SOT23 Package (R = Solder Paste/Reflow Ovens, W = Hand-Soldering) BAT54Film 40V 300mA - Digikey: 497-7162-1-ND
D2 D3 = SamacSys_Parts:IP4234CZ6,125: TVS DIODE 5.5VWM 6TSOP Source: Datasheet <https://componentsearchengine.com/Datasheets/1/IP4234CZ6,125.pdf>; DESCRIPTION: TVS DIODE 5.5VWM 6TSOP; HEIGHT: 1.1mm; MANUFACTURER_NAME: Nexperia; MANUFACTURER_PART_NUMBER: IP4234CZ6,125; MOUSER_PART_NUMBER: 771-IP4234CZ6125; MOUSER_PRICE-STOCK: https://www.mouser.com/Search/Refine.aspx?Keyword=771-IP4234CZ6125
D4 LED0 LED1-LED7 = CEDT:LED
H1 = holes:MOUNT-PAD-ROUND: MOUNTING PAD, round
IC1 = SamacSys_Parts:10CL016YE144C8G: FPGA - Field Programmable Gate Array Source: Datasheet <https://componentsearchengine.com/Datasheets/1/10CL016YE144C8G.pdf>; DESCRIPTION: FPGA - Field Programmable Gate Array; HEIGHT: 1.65mm; MANUFACTURER_NAME: Intel; MANUFACTURER_PART_NUMBER: 10CL016YE144C8G; MOUSER_PART_NUMBER: 989-10CL016YE144C8G; MOUSER_PRICE-STOCK: https://www.mouser.com/Search/Refine.aspx?Keyword=989-10CL016YE144C8G
IC2 = texas:SN65176: DIFFERENTIAL BUS TRANSCEIVER Source: http://focus.ti.com .. sn65176b.pdf; MF: TEXAS INSTRUMENTS; MPN: SN65176BD; OC_FARNELL: 9589970; OC_NEWARK: 08F5891
JP1 = SparkFun-Connectors:M02: Standard 2-pin 0.1" header. Use with - straight break away headers ( PRT-00116) - right angle break away headers (PRT-00553) - swiss pins (PRT-00743) - machine pins (PRT-00117) - female headers (PRT-00115) Molex polarized connector foot print use with: PRT-08233 with associated crimp pins and housings. 2.54_SCREWTERM for use with PRT-10571. 3.5mm Screw Terminal footprints for PRT-08084 5mm Screw Terminal footprints for use with PRT-08433
JP2 = pinhead:PINHD-1X2: PIN HEADER
L2-L4 = 00dkeekstra:SLF7032T
LED8 = adafruit:RGBLED: For 5050 RGB LEDs, the order of the LEDs may vary from one manufacturer to another!
Q1 Q2 = special:XTAL/S: CRYSTAL
Q3 = SparkFun-DiscreteSemi:MOSFET-PCHANNEL: Generic PMOSFET; PROD_ID: TRANS-11153
R1-R5 R8 R11 R12 R17-R20 R28 R29 R33 R34 R36 = rcl:R-EU_: RESISTOR, European symbol
R6 R21-R27 R35 R37 = resistor:R-EU_: RESISTOR, European symbol
RN1-RN3 RN5-RN7 RN13 = resistor-array:744-8: CTS 744 Series 4 Resistors, 8 Terminations
RS485 = con-wago-508:W237-3E: WAGO SREW CLAMP; OC_FARNELL: unknown; OC_NEWARK: unknown
S1-S5 = SamacSys_Parts:SKQGADE010: Tact switch,SMT,SPST,with stem,2.55N o/f Stem Tactile Switch, SPST-NO 50 mA 1.5mm Source: Datasheet <https://componentsearchengine.com/Datasheets/1/SKQGADE010.pdf>; DESCRIPTION: Tact switch,SMT,SPST,with stem,2.55N o/f Stem Tactile Switch, SPST-NO 50 mA 1.5mm; HEIGHT: mm; MANUFACTURER_NAME: ALPS; MANUFACTURER_PART_NUMBER: SKQGADE010; MOUSER_PART_NUMBER: 688-SKQGAD; MOUSER_PRICE-STOCK: https://www.mouser.com/Search/Refine.aspx?Keyword=688-SKQGAD
S6 = smd-special:SWS004: SMD Dip Switch 4 pol.
SJ2 = jumper:SJ2W: SMD solder JUMPER
SJ3 SJ4 SJ6 = jumper:SJ: SMD solder JUMPER
SV1 = con-lsta:FE05-1: FEMALE HEADER; OC_FARNELL: unknown; OC_NEWARK: unknown
SV4 = con-lstb:MA20-2: PIN HEADER; OC_FARNELL: unknown; OC_NEWARK: unknown
U1 = Tristan+Robitaille's+Library:SI5351A_CLOCK_GEN: Si5351A I2C-PROGRAMMABLE ANY-FREQUENCY CMOS CLOCK GENERATOR + VCXO Technical specifications: Frequency output range: 2.5kHz to 200MHz Supply voltage: 3.3V to 2.5V Current dRAW: 22mA Datasheet <http://www.silabs.com/Support%20Documents/TechnicalDocs/Si5351-B.pdf> Digi-Key part #: 336-2399-5-ND <http://www.digikey.com/product-detail/en/silicon-labs/SI5351A-B-GT/336-2399-5-ND/3679847> Mouser part #: 634-SI5351A-B-GT <http://ca.mouser.com/ProductDetail/Silicon-Labs/Si5351A-B-GT/?qs=sGAEpiMZZMvo8iywG0hSDWs06v8jDJjKxCv2r5wdINo%3d> Manufacturer part #: SI5351A-B-GT
U2 = SparkFun-FreqCtrl_good:OSCILLATOR: Generic 5x3 and 7x5 oscillators
U3 = PIC18F14K50-I_SS:PIC18F14K50-I/SS: Flash Microcontrollers; AVAILABILITY: Unavailable; DESCRIPTION: PIC18 Series 768 B RAM 16 kB Flash 8-Bit Enhanced Microcontroller - SSOP-20; MF: Microchip; MP: PIC18F14K50-I/SS; PACKAGE: SSOP-20 Microchip; PRICE: None
U4 = 00dkeekstra:IS25LQ040B-JNLE
U$1 = open-ephys:HDMI: Horizonal HDMI type "A" jack
U$3 U$7 U$11 = 00dkeekstra:AP3429
X1 X2 = con-cypressindustries:MINI-USB-: MINI USB-B Conector Source: www.cypressindustries.com; OC_FARNELL: unknown; OC_NEWARK: unknown